# EAGLE design APRS Mini (EAGLE 5.11)
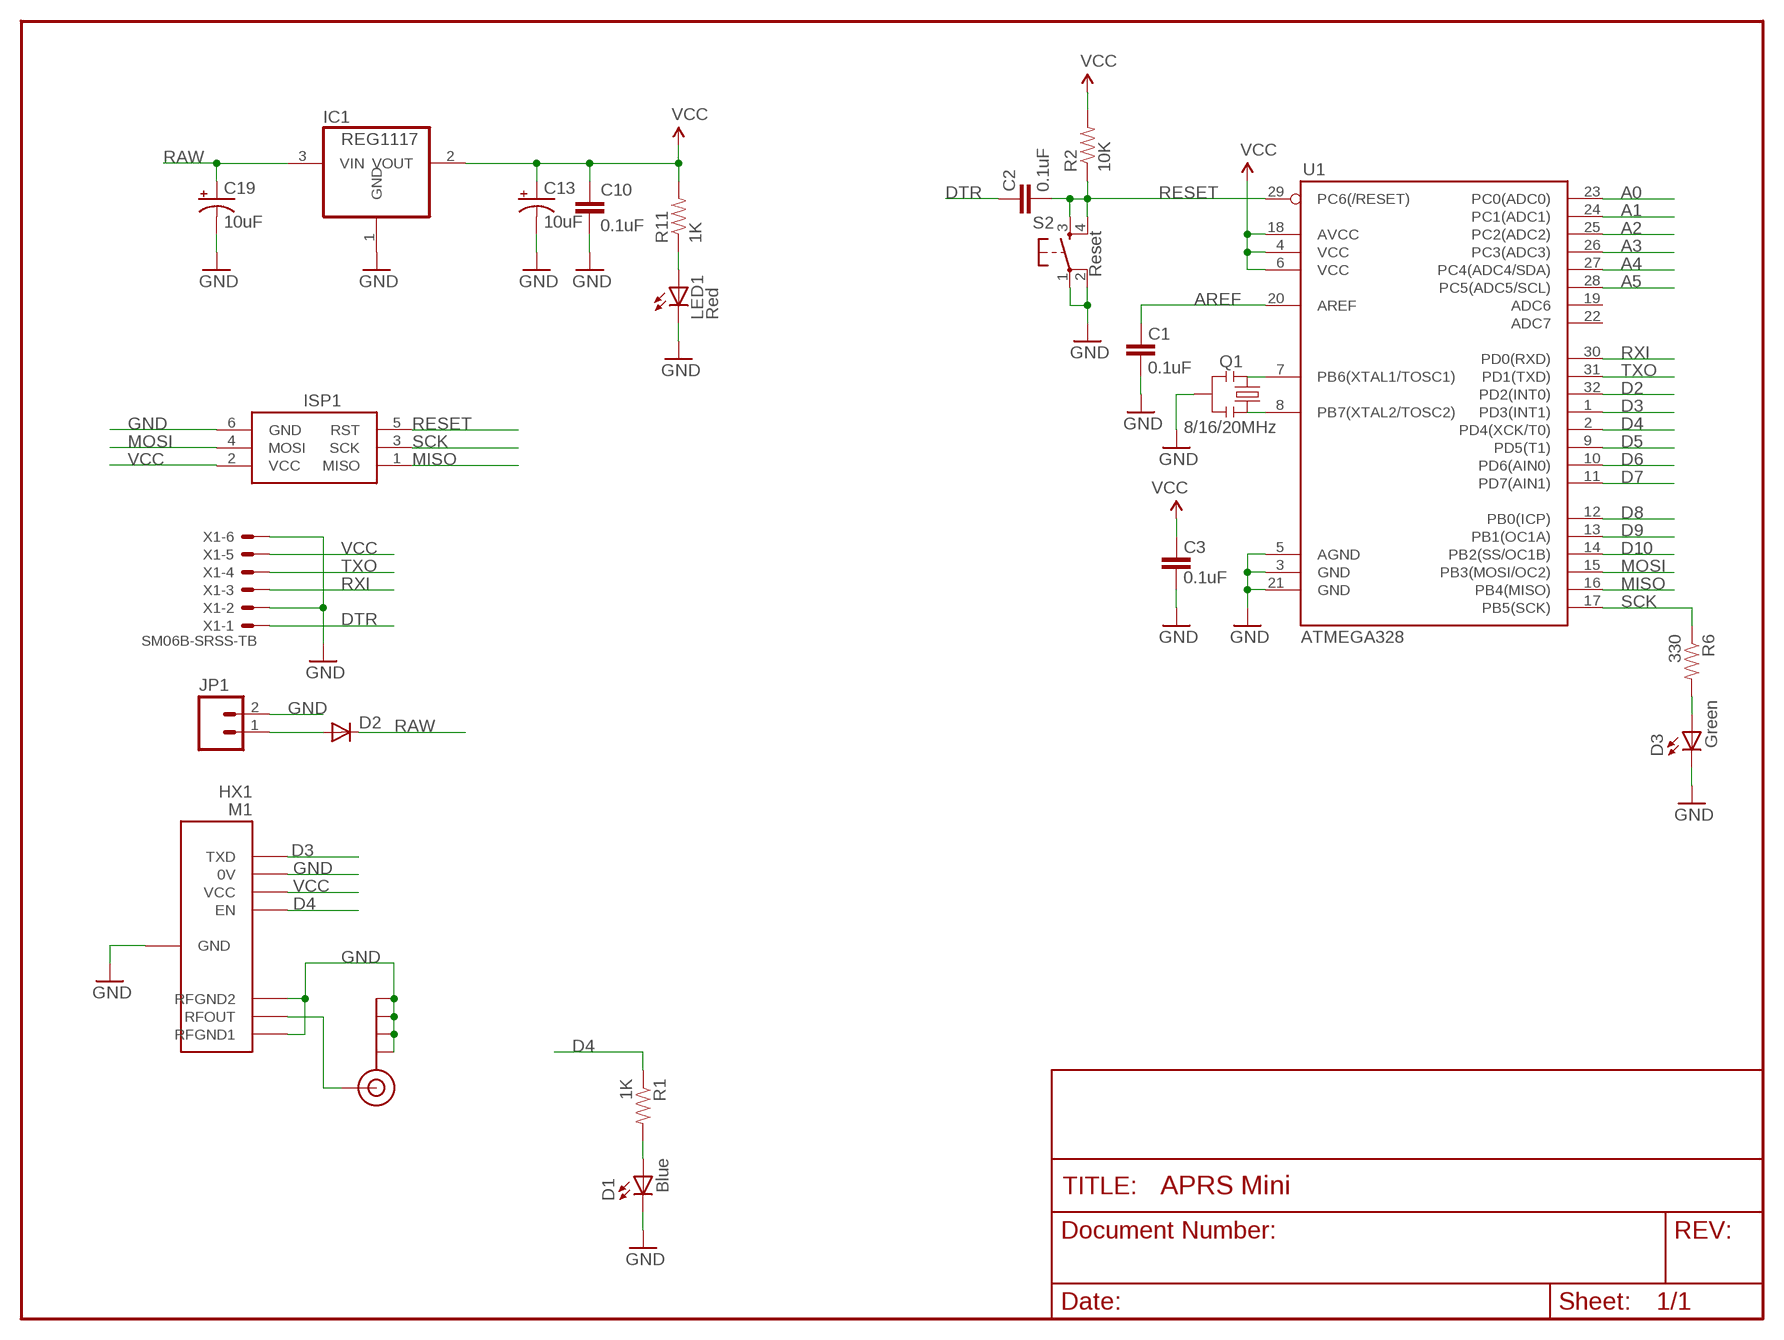
[diagram p0: schematic, sheet 1]

## Parts
C1  0.1uF  CAP0402-CAP  [0402-CAP]
C2  0.1uF  CAP0402-CAP  [0402-CAP]
C3  0.1uF  CAP0402-CAP  [0402-CAP]
C10  0.1uF  CAP0402-CAP  [0402-CAP]
C13  10uF  CAP_POL1206  [EIA3216]
C19  10uF  CAP_POL1206  [EIA3216]
D1  Blue  LED0603  [LED-0603]
D2  DIODESOD  [SOD-323]
D3  Green  LED0603  [LED-0603]
IC1  REG1117  [SOT223]
ISP1  AVRISP-6  [AVRISP]
J$1  SMA_EDGE  [SMA-EDGE]
JP1  M02  [1X02-THIN]
LED1  Red  LED0603  [LED-0603]
M1  HX1  [HX1]
Q1  8/16/20MHz  RESONATORSMD  [RESONATOR-SMD]
R1  1K  RESISTOR0402-RES  [0402-RES]
R2  10K  RESISTOR0402-RES  [0402-RES]
R6  330  RESISTOR0402-RES  [0402-RES]
R11  1K  RESISTOR0402-RES  [0402-RES]
S2  Reset  TAC_SWITCHSMD  [TACTILE_SWITCH_SMD]
U1  ATMEGA328  ATMEGA168  [TQFP32-08]
X1  SM06B-SRSS-TB  [SM06B-SRSS-TB]

## Nets
A0: U1.23(PC0(ADC0))
A1: U1.24(PC1(ADC1))
A2: U1.25(PC2(ADC2))
A3: U1.26(PC3(ADC3))
A4: U1.27(PC4(ADC4/SDA))
A5: U1.28(PC5(ADC5/SCL))
AREF: C1.2 U1.20(AREF)
D2: U1.32(PD2(INT0))
D3: M1.TXD U1.1(PD3(INT1))
D4: M1.EN R1.1 U1.2(PD4(XCK/T0))
D5: U1.9(PD5(T1))
D6: U1.10(PD6(AIN0))
D7: U1.11(PD7(AIN1))
D8: U1.12(PB0(ICP))
D9: U1.13(PB1(OC1A))
D10: U1.14(PB2(SS/OC1B))
DTR: C2.2 X1.1
GND [vcc]: C1.1 C3.1 C10.2 C13.C(-) C19.C(-) D1.C D3.C IC1.1(GND) ISP1.6(GND) J$1.GND@0(GND) J$1.GND@1(GND) J$1.GND@2(GND) J$1.GND@3(GND) JP1.2 LED1.C M1.0V M1.GND M1.RFGND1 M1.RFGND2 Q1.2 S2.1 S2.2 U1.3(GND) U1.5(AGND) U1.21(GND) X1.2 X1.6
MISO: ISP1.1(MISO) U1.16(PB4(MISO))
MOSI: ISP1.4(MOSI) U1.15(PB3(MOSI/OC2))
N$1: Q1.1 U1.8(PB7(XTAL2/TOSC2))
N$2: Q1.3 U1.7(PB6(XTAL1/TOSC1))
N$3: D1.A R1.2
N$5: J$1.SIG(SIGNAL) M1.RFOUT
N$7: D3.A R6.2
N$8: D2.2(A) JP1.1
N$38: LED1.A R11.1
RAW [vcc]: C19.A(+) D2.1(C) IC1.3(VIN)
RESET: C2.1 ISP1.5(RST) R2.1 S2.3 S2.4 U1.29(PC6(/RESET))
RXI: U1.30(PD0(RXD)) X1.3
SCK: ISP1.3(SCK) R6.1 U1.17(PB5(SCK))
TXO: U1.31(PD1(TXD)) X1.4
VCC: C3.2 C10.1 C13.A(+) IC1.2(VOUT) ISP1.2(VCC) M1.VCC R2.2 R11.2 U1.4(VCC) U1.6(VCC) U1.18(AVCC) X1.5
Unconnected: U1.19(ADC6) U1.22(ADC7)

## Library data of the parts
C1-C3 C10 = SparkFun:CAP: Capacitor Standard 0603 ceramic capacitor, and 0.1" leaded capacitor.
C13 C19 = SparkFun:CAP_POL: Capacitor Polarized These are standard SMD and PTH capacitors. Normally 10uF, 47uF, and 100uF in electrolytic and tantalum varieties. Always verify the external diameter of the through hole cap, it varies with capacity, voltage, and manufacturer. The EIA devices should be standard.
D1 D3 LED1 = SparkFun:LED: LEDs Standard schematic elements and footprints for 5mm, 3mm, 1206, and 0603 sized LEDs. 5mm - Spark Fun Electronics SKU : COM-00529 (and others)
D2 = SparkFun:DIODE: Diode These are standard reverse protection diodes and small signal diodes. SMA package can handle up to about 1A. SOD-323 can handle about 200mA. What the SOD-323 package when ordering, there are some mfgs out there that are 5-pin packages.
IC1 = burr-brown:REG1117: 800mA and 1A Low Dropout (LDO) Positive Regulator 1.8V, 2.5V, 2.85V, 3.3V, 5V, and Adj; MPN: REG1117; OC_FARNELL: 1097566; OC_NEWARK: 14P6981
ISP1 = adafruit:AVRISP: AVR ISP HEADER Standard 6 pin header for AVR programming
J$1 = SparkFun:SMA_EDGE: SMA Antenna Connector End launch SMA connector. The paste layer has been removed so that the connector can be hand soldered onto the board after reflow.
JP1 = SparkFun:M02: Header 2 Standard 2-pin 0.1" header. Use with straight break away headers (SKU : PRT-00116), right angle break away headers (PRT-00553), swiss pins (PRT-00743), machine pins (PRT-00117), and female headers (PRT-00115). Molex polarized connector foot print use with SKU : PRT-08233 with associated crimp pins and housings.
M1 = trackuino:HX1
Q1 = SparkFun:RESONATOR: Resonator Small SMD resonator. This is the itty bitty 10/20MHz resonators with built in caps. CSTCE10M0G55 and CSTCE20M0V53. Footprint has been reviewed closely but hasn't been tested yet.
R1 R2 R6 R11 = SparkFun:RESISTOR: Resistor Basic schematic elements and footprints for 0603, 1206, and PTH resistors.
S2 = SparkFun:TAC_SWITCH: Momentary Switch Button commonly used for reset or general input. Spark Fun Electronics SKU : COM-00097
U1 = SparkFun:ATMEGA168
X1 = con-jst2:?M06B-SRSS-TB: Disconnectable Crimp style connector, 1.0mm pitch 6 contacts

## Net classes
0 default: width 0.203 mm
1 vcc: width 0.254 mm

## Board
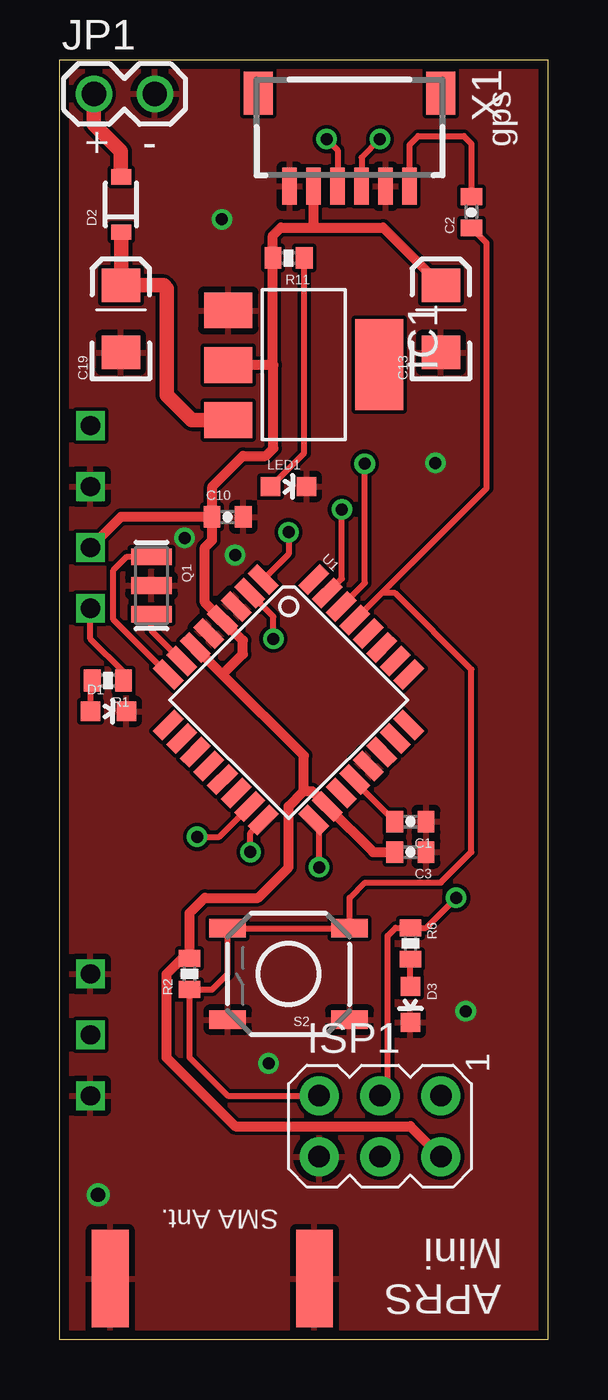
[diagram p1: board, top side]
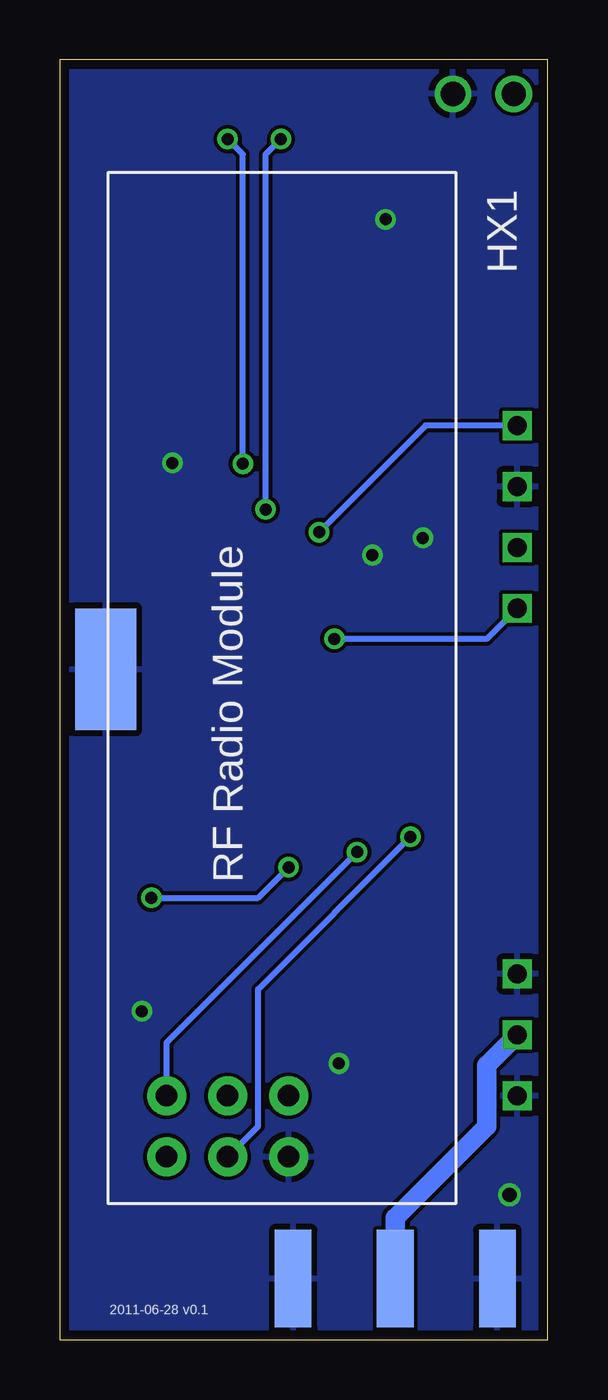
[diagram p2: board, bottom side, seen from below]

Size 20.32 x 53.34 mm. Coordinates in mm from the lower left corner, seen from the top.
Outline: 0,0 0,53.34 20.32,53.34 20.32,0 0,0
Copper layers (1*16): Top 0.0356mm / dielectric 1.5011mm / Bottom 0.0356mm
Design rules "LaenPCBOrder": minimum track width 6mil, minimum drill 13mil, track to track 6mil, track to pad 6mil, pad to pad 6mil, via to via 6mil, smd to smd 6mil, copper to edge 15mil, drill to drill 6mil, minimum pad ring 7mil, minimum via ring 7mil, stop-mask expansion 4mil, vias tented up to drill 0mil, thermal gap 10mil

### Footprints (pad centres in the part's own frame; a part is rotated, then mirrored left to right if it is on the bottom)
0402-CAP = smd 0.7 x 0.9: 1 -0.65,0; 2 0.65,0
EIA3216 = smd 1.4 x 1.6: A 1.4,0; C -1.4,0
LED-0603 = smd 0.8 x 0.8: A 0,-0.75; C 0,0.75
SOD-323 = smd 0.63 x 0.83: 1 -1.15,0; 2 1.15,0
SOT223 = smd 1.499 x 2.007: 1 -2.261,-3.15; 2 0.025,-3.15; 3 2.311,-3.15 | smd 3.81 x 2.007: 4 0,3.15
AVRISP = drill 0.9 pad 1.626 round: 1 -1.27,2.54; 2 1.27,2.54; 3 -1.27,0; 4 1.27,0; 5 -1.27,-2.54; 6 1.27,-2.54
SMA-EDGE = smd 1.524 x 4.064: GND@0 -4.255,0; GND@1 4.255,0; SIG 0,0 | smd 1.524 x 4.064 bottom: GND@2 -4.255,0; GND@3 4.255,0
1X02-THIN = drill 1.016 round: 1 0,0; 2 2.54,0
HX1 = drill 0.8 square: 0V 25.4,-8.89; EN 20.32,-8.89; RFGND1 0,-8.89; RFGND2 5.08,-8.89; RFOUT 2.54,-8.89; TXD 27.94,-8.89; VCC 22.86,-8.89 | smd 5.08 x 2.54: GND 17.78,8.255
RESONATOR-SMD = smd 0.7 x 1.7: 1 -1.2,0; 2 0,0; 3 1.2,0
0402-RES = smd 0.7 x 0.9: 1 -0.65,0; 2 0.65,0
TACTILE_SWITCH_SMD = smd 1.524 x 0.762: 1 -2.54,1.905; 2 2.54,1.905; 3 -2.54,-1.905; 4 2.54,-1.905
TQFP32-08 = smd 1.27 x 0.559: 1 -4.293,2.8; 2 -4.293,2; 3 -4.293,1.2; 4 -4.293,0.4; 5 -4.293,-0.4; 6 -4.293,-1.2; 7 -4.293,-2; 8 -4.293,-2.8; 17 4.293,-2.8; 18 4.293,-2; 19 4.293,-1.2; 20 4.293,-0.4; 21 4.293,0.4; 22 4.293,1.2; 23 4.293,2; 24 4.293,2.8 | smd 0.559 x 1.27: 9 -2.8,-4.293; 10 -2,-4.293; 11 -1.2,-4.293; 12 -0.4,-4.293; 13 0.4,-4.293; 14 1.2,-4.293; 15 2,-4.293; 16 2.8,-4.293; 25 2.8,4.293; 26 2,4.293; 27 1.2,4.293; 28 0.4,4.293; 29 -0.4,4.293; 30 -1.2,4.293; 31 -2,4.293; 32 -2.8,4.293
SM06B-SRSS-TB = smd 0.6 x 1.55: 1 -2.5,2.975; 2 -1.5,2.975; 3 -0.5,2.975; 4 0.5,2.975; 5 1.5,2.975; 6 2.5,2.975 | smd 1.2 x 1.8: FIT@1 -3.8,-0.9; FIT@2 3.8,-0.9

### Placement (x,y rotation side)
C1  14.61,21.59 180 top
C2  17.14,46.99 90 top
C3  14.61,20.32 180 top
C10  6.99,34.29 0 top
C13  15.88,42.55 90 top
C19  2.54,42.55 90 top
D1  2.02,26.19 270 top
D2  2.54,47.31 90 top
D3  14.61,13.97 180 top
IC1  10.16,40.64 270 top
ISP1  13.34,8.89 270 top
J$1  6.35,2.54 0 bottom
JP1  1.41,51.93 0 top
LED1  9.53,35.56 270 top
M1  10.16,10.16 90 bottom
Q1  3.81,31.43 270 top
R1  2,27.47 180 top
R2  5.4,15.24 90 top
R6  14.61,16.51 270 top
R11  9.53,45.09 180 top
S2  9.53,15.24 180 top
U1  9.53,26.67 315 top
X1  12.06,51.05 180 top

### Tracks (layer width: path | path; a pad name or v marks a point on that pad's centre or on a via)
AREF
  Top 0.254: U1.20 12.28,23.27 C1.2
D3  (via drill 0.5)
  Top 0.254: U1.1 9.53,32.74 v9.53,33.66
  Bottom 0.254: v9.53,33.66 5.08,38.1 M1.TXD
D4  (via drill 0.5)
  Top 0.254: v8.89,29.21 8.89,30.13 U1.2 | R1.1 2.65,27.83 1.27,29.21 M1.EN
  Bottom 0.254: M1.EN 2.54,29.21 v8.89,29.21
DTR
  Top 0.254: X1.1 14.56,49.81 14.92,50.16 16.83,50.16 17.14,49.85 C2.2
GND  (via drill 0.5, 0.6)
  other vias: 1.59,6.03 5.2,33.41 7.3,32.7 8.7,11.51 16.91,13.68 15.64,36.54 6.75,46.7
  pour Top: 0,53.34 20.32,53.34 20.32,0 0,0
  pour Bottom: 0,53.34 20.32,53.34 20.32,0 0,0
MISO  (via drill 0.5)
  Top 0.254: U1.16 7.94,21.12 v7.94,20.32
  Bottom 0.254: v7.94,20.32 15.88,12.38 ISP1.1
MOSI  (via drill 0.5)
  Top 0.254: U1.15 6.64,20.95 v5.71,20.95
  Bottom 0.254: v5.71,20.95 12.06,14.61 12.06,8.89 ISP1.4
N$1
  Top 0.254: Q1.1 2.79,32.63 2.22,32.07 2.22,30.01 U1.8
N$2
  Top 0.254: Q1.3 3.81,29.56 U1.7
N$3
  Top 0.254: R1.2 arc90 1.27,27.39 D1.A
N$5
  Bottom 0.813: M1.RFOUT 2.54,11.43 2.54,8.89 6.35,5.08 J$1.SIG
N$7
  Top 0.254: D3.A R6.2
N$8
  Top 0.61: JP1.1 1.41,50.66 2.54,49.53 D2.2
N$38
  Top 0.254: R11.1 10.18,36.96 LED1.A
RAW
  Top 0.61: IC1.3 5.49,38.33 4.45,39.37 4.45,43.81 4.32,43.95 C19.A D2.1
RESET
  Top 0.254: 13.4,31.11 13.97,31.11 17.14,27.94 17.14,20.32 15.88,19.05 12.7,19.05 12.06,18.41 S2.3 S2.4 6.99,15.24 6.33,14.59 R2.1 5.4,11.75 6.99,10.16 ISP1.5 | 13.4,31.11 U1.29 | C2.1 17.78,45.7 17.78,35.49 13.4,31.11
RXI  (via drill 0.5)
  Top 0.254: U1.30 12.7,31.54 v12.7,36.51 | X1.3 12.56,49.27 v13.34,50.04
  Bottom 0.254: v12.7,36.51 12.7,49.4 v13.34,50.04
SCK  (via drill 0.5)
  Top 0.254: U1.17 10.79,21.44 v10.79,19.68 | v16.51,18.41 15.26,17.16 R6.1 13.98,17.16 13.65,16.83 13.65,10.48 ISP1.3
  Bottom 0.254: v16.51,18.41 12.06,18.41 v10.79,19.68
TXO  (via drill 0.5)
  Top 0.254: U1.31 11.75,31.72 v11.75,34.61 | X1.4 11.56,49.59 v11.11,50.04
  Bottom 0.254: v11.75,34.61 11.75,49.4 v11.11,50.04
VCC
  Top 0.254: 8.89,40.64 8.88,40.66 | 6.35,34.3 C10.1 6.35,34.27
  Top 0.406: C3.2 13.05,20.32 U1.18 10.51,22.86 10.16,22.86 | 10.16,22.86 9.53,22.23 9.53,19.68 8.26,18.41 6.03,18.41 5.4,17.78 R2.2 5.09,15.89 4.45,15.24 4.45,11.75 7.3,8.89 14.61,8.89 ISP1.2 | 6.77,27.73 10.16,24.34 10.16,22.86 | 6.77,27.73 U1.6 | 8.88,40.66 R11.2 8.88,46.02 9.21,46.35 10.56,46.35 | 6.35,34.3 6.35,35.56 7.62,36.83 8.57,36.83 8.89,37.15 8.89,40.62 | 6.77,27.73 7.62,28.57 7.62,29.14 U1.4 6.03,30.73 6.03,33.02 6.33,33.32 C10.1 2.54,34.29 M1.VCC | C13.A 13.46,46.35 10.56,46.35 | 10.56,46.35 X1.5 | 8.89,40.62 IC1.2 | 8.89,40.62 8.89,40.64

### Text on the board
tPlace: gps | + | - | SMA Ant. | Mini | APRS
bPlace: RF Radio Module | 2011-06-28 v0.1